# Altium schematic sheet WC_SRAM.SchDoc
size A; Organization: Altium Limited; Address1: L3, 12a Rodborough Rd; Address2: Frenchs Forest; Address3: NSW; Address4: Australia 2086; DocumentNumber: 5; SheetNumber: 5; SheetTotal: 11
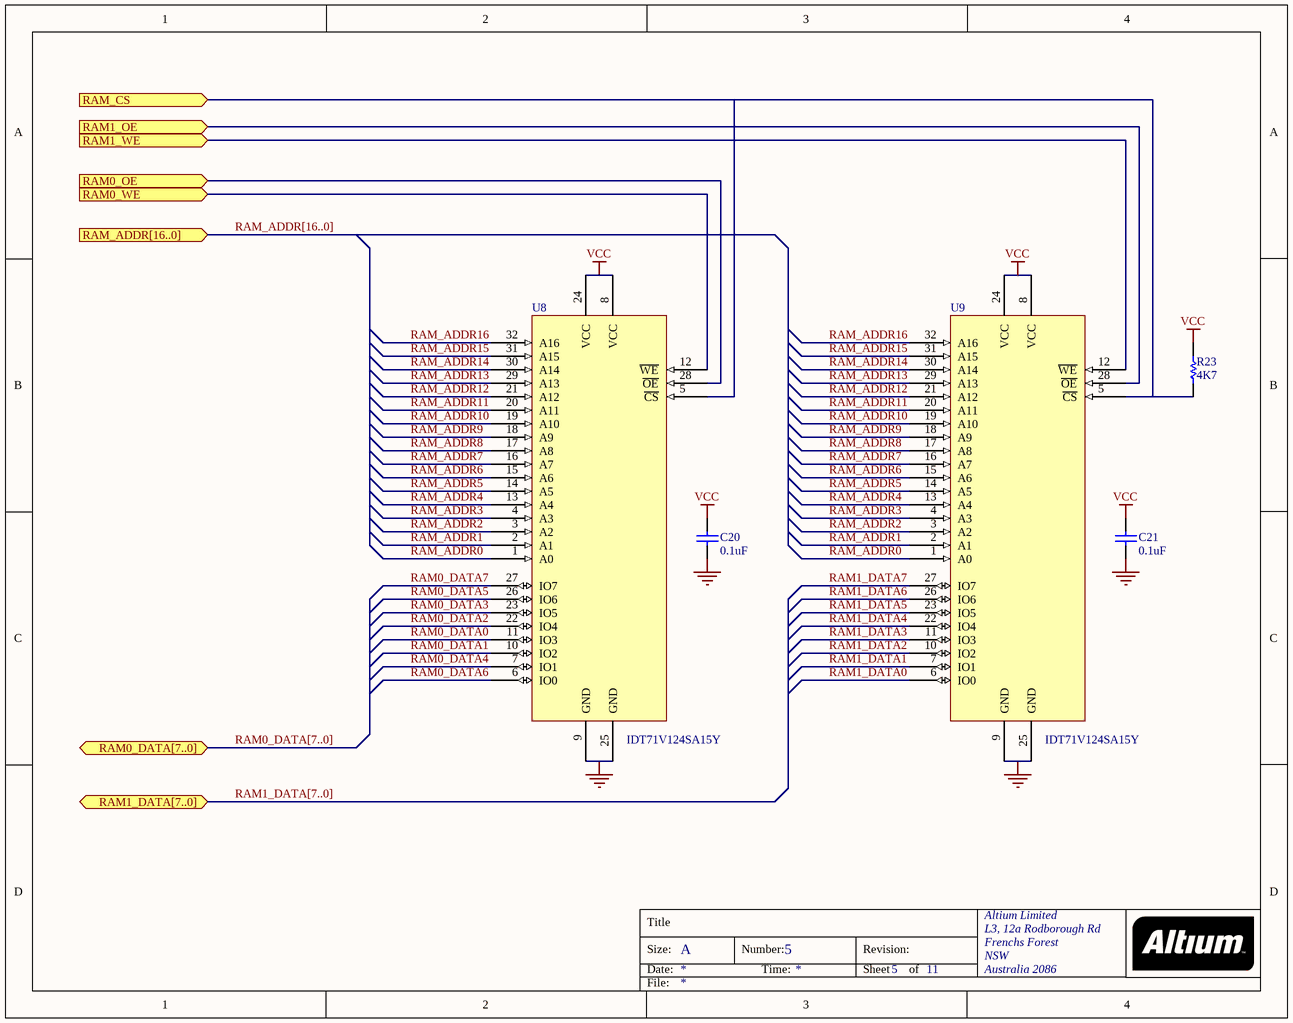
[diagram p0: WC_SRAM.SchDoc]

## Parts
C20  0.1uF  [CC2012-0805]
C21  0.1uF  [CC2012-0805]
R23  4K7  [CC2012-0805]
U8  IDT71V124SA15Y  [SO-J32]
U9  IDT71V124SA15Y  [SO-J32]

## Ports
RAM0_DATA[7..0] (bidir), RAM0_OE (in), RAM0_WE (in), RAM1_DATA[7..0] (bidir), RAM1_OE (in), RAM1_WE (in), RAM_ADDR[16..0] (in), RAM_CS (in)

## Nets
GND: C20.2 C21.2 U8.9(GND) U8.25(GND) U9.9(GND) U9.25(GND)
VCC: C20.1 C21.1 R23.1 U8.8(VCC) U8.24(VCC) U9.8(VCC) U9.24(VCC)
RAM0_DATA0: U8.11(IO3)
RAM0_DATA1: U8.10(IO2)
RAM0_DATA2: U8.22(IO4)
RAM0_DATA3: U8.23(IO5)
RAM0_DATA4: U8.7(IO1)
RAM0_DATA5: U8.26(IO6)
RAM0_DATA6: U8.6(IO0)
RAM0_DATA7: U8.27(IO7)
RAM0_OE: U8.28(~{OE}) ; port RAM0_OE
RAM0_WE: U8.12(~{WE}) ; port RAM0_WE
RAM1_DATA0: U9.6(IO0)
RAM1_DATA1: U9.7(IO1)
RAM1_DATA2: U9.10(IO2)
RAM1_DATA3: U9.11(IO3)
RAM1_DATA4: U9.22(IO4)
RAM1_DATA5: U9.23(IO5)
RAM1_DATA6: U9.26(IO6)
RAM1_DATA7: U9.27(IO7)
RAM1_OE: U9.28(~{OE}) ; port RAM1_OE
RAM1_WE: U9.12(~{WE}) ; port RAM1_WE
RAM_ADDR0: U8.1(A0) U9.1(A0)
RAM_ADDR1: U8.2(A1) U9.2(A1)
RAM_ADDR2: U8.3(A2) U9.3(A2)
RAM_ADDR3: U8.4(A3) U9.4(A3)
RAM_ADDR4: U8.13(A4) U9.13(A4)
RAM_ADDR5: U8.14(A5) U9.14(A5)
RAM_ADDR6: U8.15(A6) U9.15(A6)
RAM_ADDR7: U8.16(A7) U9.16(A7)
RAM_ADDR8: U8.17(A8) U9.17(A8)
RAM_ADDR9: U8.18(A9) U9.18(A9)
RAM_ADDR10: U8.19(A10) U9.19(A10)
RAM_ADDR11: U8.20(A11) U9.20(A11)
RAM_ADDR12: U8.21(A12) U9.21(A12)
RAM_ADDR13: U8.29(A13) U9.29(A13)
RAM_ADDR14: U8.30(A14) U9.30(A14)
RAM_ADDR15: U8.31(A15) U9.31(A15)
RAM_ADDR16: U8.32(A16) U9.32(A16)
RAM_CS: R23.2 U8.5(~{CS}) U9.5(~{CS}) ; port RAM_CS

## Buses and harness runs
bus RAM0_DATA[7..0] = port RAM0_DATA[7..0]
bus RAM1_DATA[7..0] = port RAM1_DATA[7..0]
bus RAM_ADDR[16..0] = port RAM_ADDR[16..0]

## Notes on the sheet
- Title
- Size:
- Date:
- A
- Number:
- Time:
- Revision:
- Sheet
- of
- File:

## Library data of the parts
C20 C21 = CAP: Capacitor; Supplier: FARNELL; Supplier Code: 317-287
R23 = RES: Resistor
U8 U9 = IDT71V124SA15Y: 128K x 8 bit Fast Static RAM; Supplier: IDT